# Altium schematic sheet MCU.SchDoc
size 420 x 297 mm; SheetNumber: 4; SheetTotal: 6
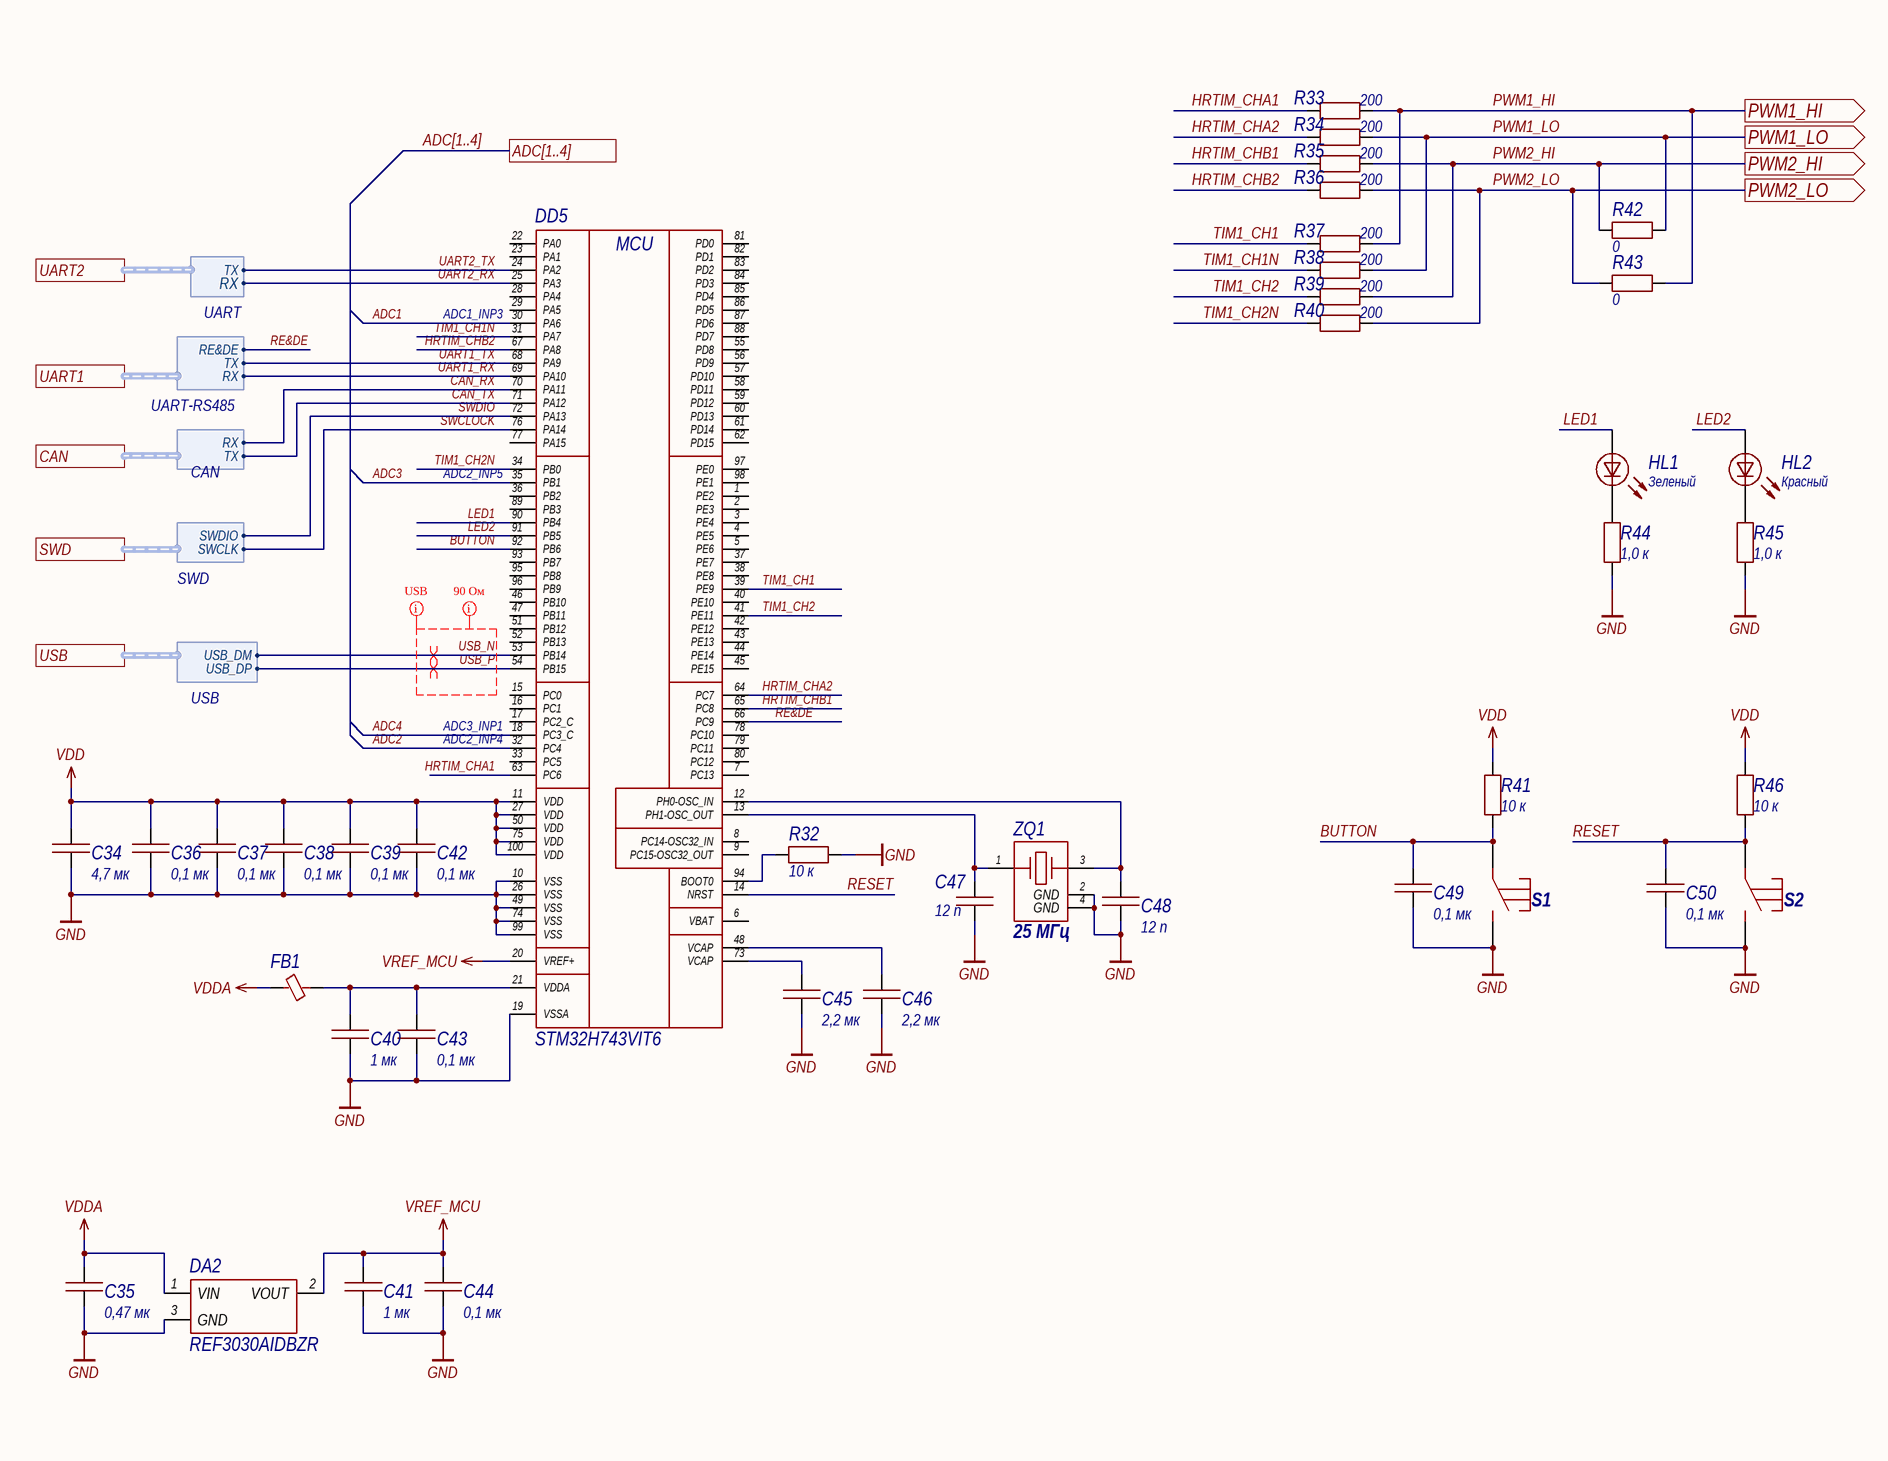
[diagram p0: MCU.SchDoc, left]
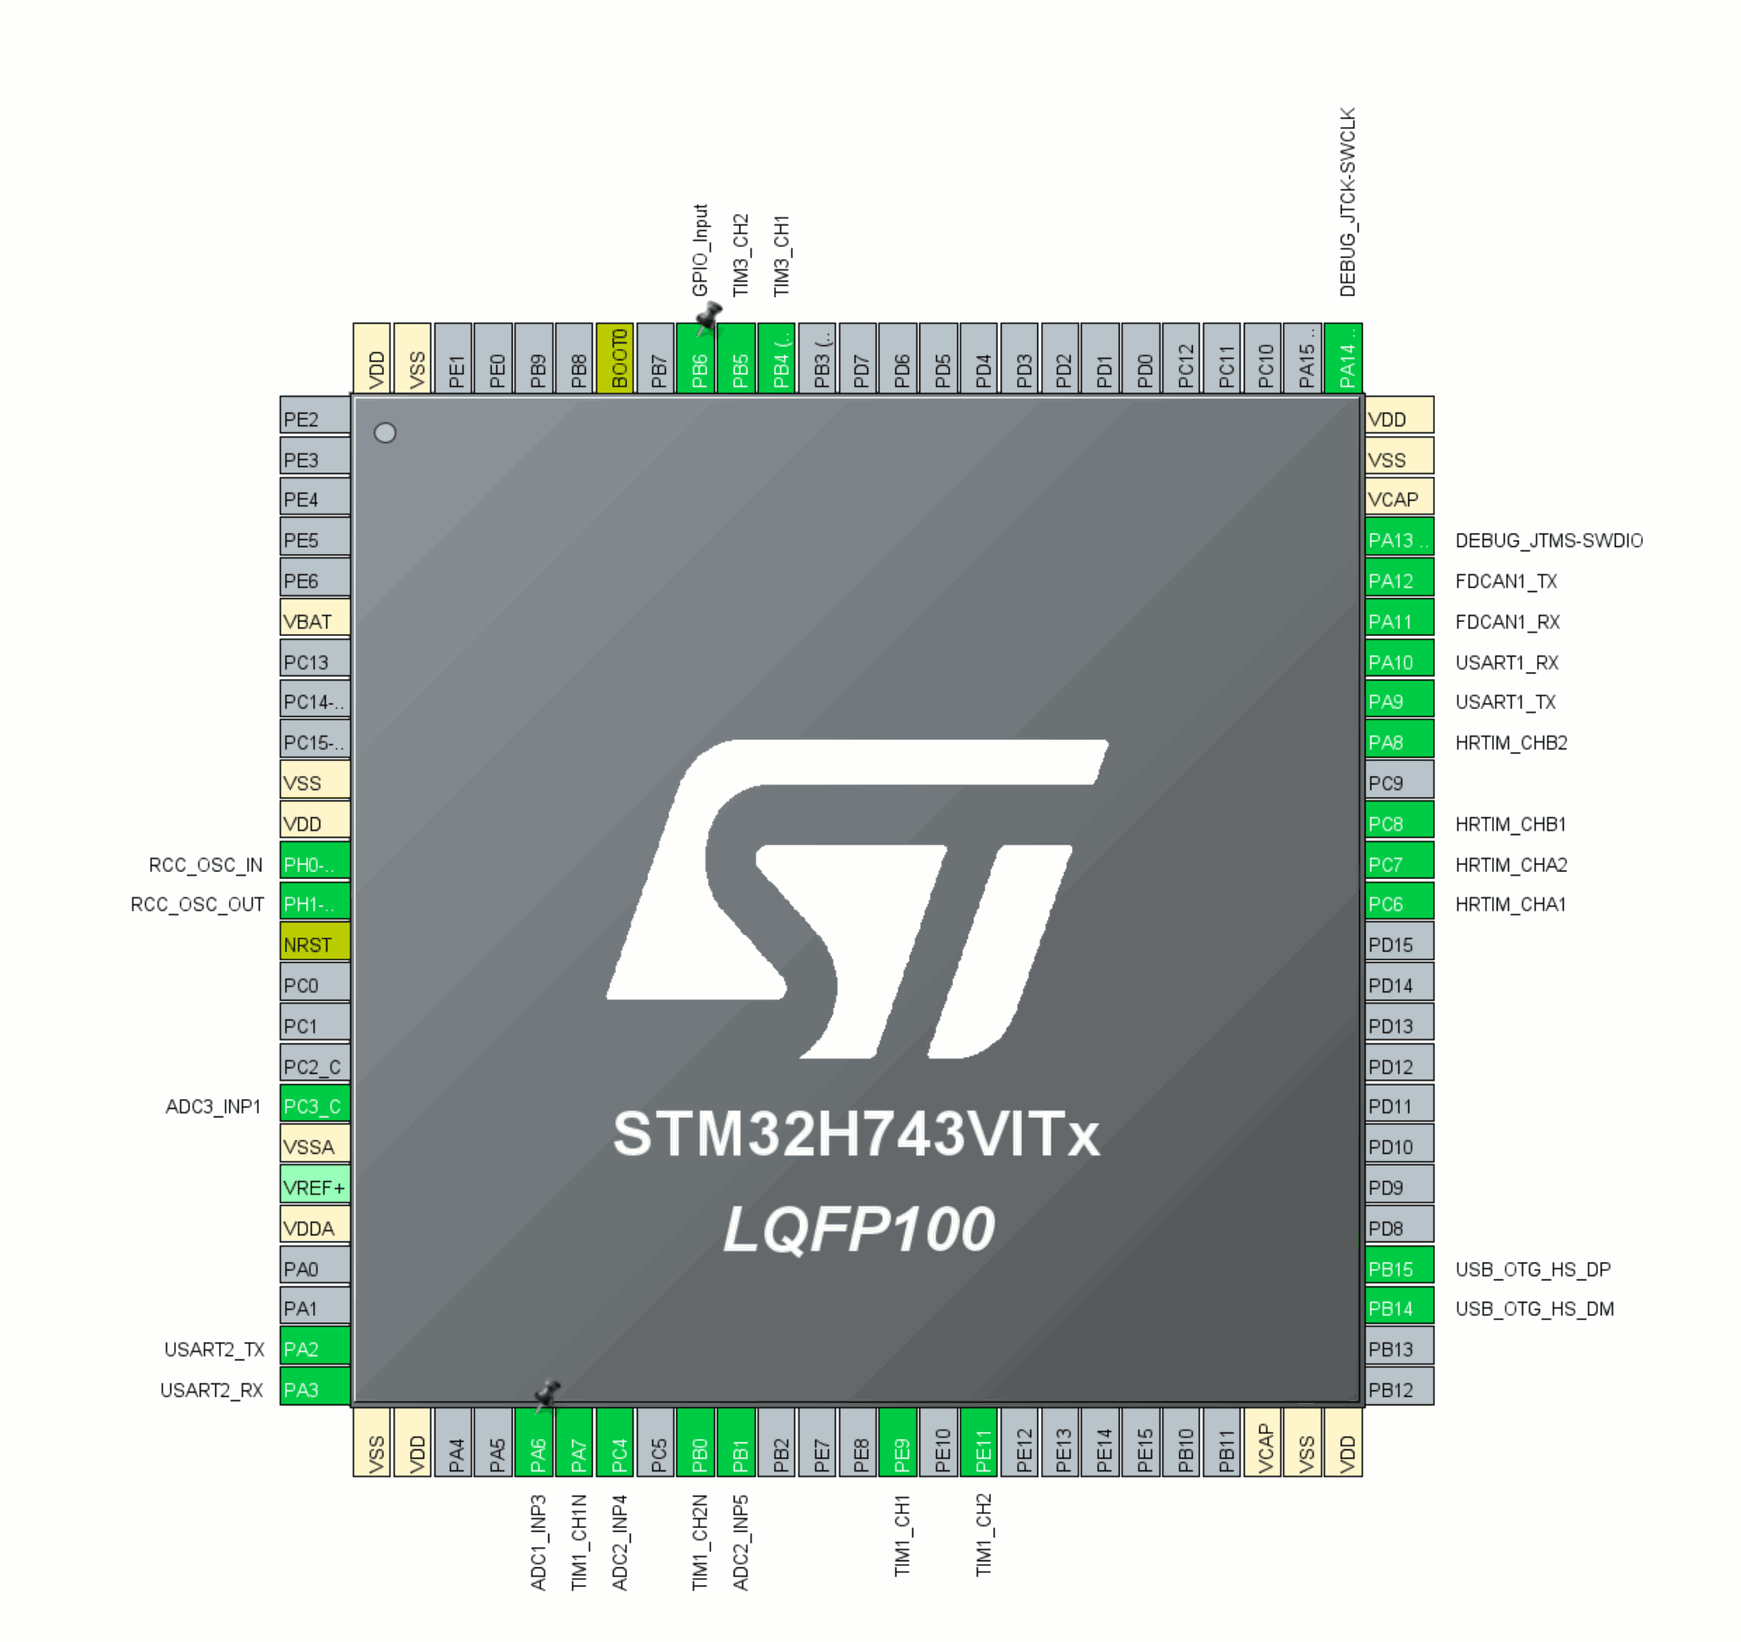
[diagram p1: MCU.SchDoc, right]

## Parts
C34  value 4,7 мк  [1206C]  (hidden comment: Capacitor)
C35  value 0,47 мк  [0603C]  (hidden comment: Capacitor)
C36  value 0,1 мк  [0603C]  (hidden comment: Capacitor)
C37  value 0,1 мк  [0603C]  (hidden comment: Capacitor)
C38  value 0,1 мк  [0603C]  (hidden comment: Capacitor)
C39  value 0,1 мк  [0603C]  (hidden comment: Capacitor)
C40  value 1 мк  [0603C]  (hidden comment: Capacitor)
C41  value 1 мк  [0603C]  (hidden comment: Capacitor)
C42  value 0,1 мк  [0603C]  (hidden comment: Capacitor)
C43  value 0,1 мк  [0603C]  (hidden comment: Capacitor)
C44  value 0,1 мк  [0603C]  (hidden comment: Capacitor)
C45  value 2,2 мк  [1206C]  (hidden comment: Capacitor)
C46  value 2,2 мк  [1206C]  (hidden comment: Capacitor)
C47  value 12 п  [0603C]  (hidden comment: Capacitor)
C48  value 12 п  [0603C]  (hidden comment: Capacitor)
C49  value 0,1 мк  [0603C]  (hidden comment: Capacitor)
C50  value 0,1 мк  [0603C]  (hidden comment: Capacitor)
DA2  REF3030AIDBZR  [SOT23-3]
DD5  STM32H743VIT6  [LQFP100]
FB1  BLM18AG102SN1D  [0603L]  (value not drawn)
HL1  value Зеленый  [0805D]  (hidden comment: LED)
HL2  value Красный  [0805D]  (hidden comment: LED)
R32  value 10 к  [0603R]  (hidden comment: Resistor)
R33  value 200  [0603R]  (hidden comment: Resistor)
R34  value 200  [0603R]  (hidden comment: Resistor)
R35  value 200  [0603R]  (hidden comment: Resistor)
R36  value 200  [0603R]  (hidden comment: Resistor)
R37  value 200  [0603R]  (hidden comment: Resistor)
R38  value 200  [0603R]  (hidden comment: Resistor)
R39  value 200  [0603R]  (hidden comment: Resistor)
R40  value 200  [0603R]  (hidden comment: Resistor)
R41  value 10 к  [0603R]  (hidden comment: Resistor)
R42  value 0  [0603R]  (hidden comment: Resistor)
R43  value 0  [0603R]  (hidden comment: Resistor)
R44  value 1,0 к  [0603R]  (hidden comment: Resistor)
R45  value 1,0 к  [0603R]  (hidden comment: Resistor)
R46  value 10 к  [0603R]  (hidden comment: Resistor)
S1  TSS-TD-19XA-XTR  [TSS-TD-19XA-XTR]  (value not drawn)
S2  TSS-TD-19XA-XTR  [TSS-TD-19XA-XTR]  (value not drawn)
ZQ1  value 25 МГц  [X322525MOB4SI]  (hidden comment: X322525MOB4SI)

## Ports
ADC[1..4], CAN (harness CAN), PWM1_HI (out), PWM1_LO (out), PWM2_HI (out), PWM2_LO (out), SWD (harness SWD), UART1 (harness UART-RS485), UART2 (harness UART), USB (harness USB)

## Harnesses
UART: TX, RX
UART-RS485: TX, RX, RE&DE
USB: USB_DM, USB_DP
SWD: SWDIO, SWCLK
CAN: TX, RX

## Nets
GND: C34.1 C35.1 C36.1 C37.1 C38.1 C39.1 C40.1 C41.1 C42.1 C43.1 C44.1 C45.1 C46.1 C47.1 C48.1 C49.1 C50.1 DA2.3(GND) DD5.10(VSS) DD5.19(VSSA) DD5.26(VSS) DD5.49(VSS) DD5.74(VSS) DD5.99(VSS) R32.1 R44.1 R45.1 S1.2 S2.2 ZQ1.2(GND) ZQ1.4(GND)
VDD: C34.2 C36.2 C37.2 C38.2 C39.2 C42.2 DD5.11(VDD) DD5.27(VDD) DD5.50(VDD) DD5.75(VDD) DD5.100(VDD) R41.2 R46.2
VDDA: C35.2 DA2.1(VIN) FB1.1
VREF_MCU: C41.2 C44.2 DA2.2(VOUT) DD5.20(VREF+)
ADC1: DD5.30(PA6)
ADC2: DD5.32(PC4)
ADC3: DD5.35(PB1)
ADC4: DD5.18(PC3_C)
BUTTON: C49.2 DD5.92(PB6) R41.1 S1.1
CAN_RX: DD5.70(PA11) ; port CAN.RX
CAN_TX: DD5.71(PA12) ; port CAN.TX
HRTIM_CHA1: DD5.63(PC6) R33.1
HRTIM_CHA2: DD5.64(PC7) R34.1
HRTIM_CHB1: DD5.65(PC8) R35.1
HRTIM_CHB2: DD5.67(PA8) R36.1
LED1: DD5.90(PB4) HL1.1
LED2: DD5.91(PB5) HL2.1
PWM1_HI: R33.2 R37.2 R43.2 ; port PWM1_HI
PWM1_LO: R34.2 R38.2 R42.2 ; port PWM1_LO
PWM2_HI: R35.2 R39.2 R42.1 ; port PWM2_HI
PWM2_LO: R36.2 R40.2 R43.1 ; port PWM2_LO
RE&DE: DD5.66(PC9) ; port UART1.RE&DE
RESET: C50.2 DD5.14(NRST) R46.1 S2.1
SWCLOCK: DD5.76(PA14) ; port SWD.SWCLK
SWDIO: DD5.72(PA13) ; port SWD.SWDIO
TIM1_CH1: DD5.39(PE9) R37.1
TIM1_CH1N: DD5.31(PA7) R38.1
TIM1_CH2: DD5.41(PE11) R39.1
TIM1_CH2N: DD5.34(PB0) R40.1
UART1_RX: DD5.69(PA10) ; port UART1.RX
UART1_TX: DD5.68(PA9) ; port UART1.TX
UART2_RX: DD5.25(PA3) ; port UART2.RX
UART2_TX: DD5.24(PA2) ; port UART2.TX
USB_N: DD5.53(PB14) ; port USB.USB_DM
USB_P: DD5.54(PB15) ; port USB.USB_DP
NetC40_2: C40.2 C43.2 DD5.21(VDDA) FB1.2
NetC45_2: C45.2 DD5.73(VCAP)
NetC46_2: C46.2 DD5.48(VCAP)
NetC47_2: C47.2 DD5.13(PH1-OSC_OUT) ZQ1.1
NetC48_2: C48.2 DD5.12(PH0-OSC_IN) ZQ1.3
NetDD5_94: DD5.94(BOOT0) R32.2
NetHL1_2: HL1.2 R44.2
NetHL2_2: HL2.2 R45.2

Not connected (* = marked no-connect by the designer): DD5 1(PE2) 2(PE3) 3(PE4) 4(PE5) 5(PE6) 6(VBAT) 7(PC13) 8(PC14-OSC32_IN) 9(PC15-OSC32_OUT) 15(PC0) 16(PC1) 17(PC2_C) 22(PA0) 23(PA1) 28(PA4) 29(PA5) 33(PC5) 36(PB2) 37(PE7) 38(PE8) 40(PE10) 42(PE12) 43(PE13) 44(PE14) 45(PE15) 46(PB10) 47(PB11) 51(PB12) 52(PB13) 55(PD8) 56(PD9) 57(PD10) 58(PD11) 59(PD12) 60(PD13) 61(PD14) 62(PD15) 77(PA15) 78(PC10) 79(PC11) 80(PC12) 81(PD0) 82(PD1) 83(PD2) 84(PD3) 85(PD4) 86(PD5) 87(PD6) 88(PD7) 89(PB3) 93(PB7) 95(PB8) 96(PB9) 97(PE0) 98(PE1)

## Buses and harness runs
bus ADC[1..4] = port ADC[1..4]

## Layout directives
differential pair; differential pair class 90OhmDiff: USB_N, USB_P
mark named USB: USB_N, USB_P
mark named 90 Ом: USB_N, USB_P

## Notes on the sheet
- (near DD5) ADC1_INP3
- (near DD5) ADC2_INP5
- (near DD5) ADC3_INP1
- (near DD5) ADC2_INP4
- Перв. примен.
- Справ. №
- Подп. и дата
- Инв. № дубл.
- Взам. инв. №
- Инв. № подл.
- Изм.
- Лист
- № докум.
- Подп.
- Дата
- Копировал
- Формат А3
- (in symbol STM32H743VIT6) MCU

## Library data of the parts
C34 = Capacitor_4,7u_10_50V_X7R_1206C: Конденсатор 1206C ёмкостью 4,7 мк 10%, 50 В, X7R; Voltage (V): 50; Capacity (nF): 4700; Part Number: Capacitor_4,7u_10_50V_X7R_1206C; Tolerance: 10%; Dielectric: X7R
C35 = Capacitor_0,47u_10_50V_X7R_0603C: Конденсатор 0603C ёмкостью 0,47 мк 10%, 50 В, X7R; Voltage (V): 50; Capacity (nF): 470; Part Number: Capacitor_0,47u_10_50V_X7R_0603C; Tolerance: 10%; Dielectric: X7R
C36-C39 C42-C44 C49 C50 = Capacitor_0,1u_10_50V_X7R_0603C: Конденсатор 0603C ёмкостью 0,1 мк 10%, 50 В, X7R; Voltage (V): 50; Capacity (nF): 100; Part Number: Capacitor_0,1u_10_50V_X7R_0603C; Tolerance: 10%; Dielectric: X7R
C40 C41 = Capacitor_1u_10_25V_X7R_0603C: Конденсатор 0603C ёмкостью 1 мк 10%, 25 В, X7R; Voltage (V): 25; Capacity (nF): 1000; Part Number: Capacitor_1u_10_25V_X7R_0603C; Tolerance: 10%; Dielectric: X7R
C45 C46 = Capacitor_2,2u_10_50V_X7R_1206C: Конденсатор 1206C ёмкостью 2,2 мк 10%, 50 В, X7R; Voltage (V): 50; Capacity (nF): 2200; Part Number: Capacitor_2,2u_10_50V_X7R_1206C; Tolerance: 10%; Dielectric: X7R
C47 C48 = Capacitor_12p_5_50V_NP0_0603C: Конденсатор 0603C ёмкостью 12 п 5%, 50 В, NP0; Voltage (V): 50; Capacity (nF): 0,012; Автор: glebmih; Part Number: Capacitor_12p_5_50V_NP0_0603C; Tolerance: 5%; Dielectric: NP0
DA2 = REF3030AIDBZR: Источник опорного напряжения, 3В; Автор: glebmih; Part Number: REF3030AIDBZR; Datasheet: https://static.chipdip.ru/lib/248/DOC000248445.pdf
DD5 = STM32H743VIT6: Микроконтроллер, 32-Бит, Cortex-M7, 480МГц, 2Мб Flash, 1Мб SRAM, 82 I/O; MF: STMicroelectronics; Автор: glebmih; SnapEDA_Link: https://www.snapeda.com/parts/STM32H743VIT6/STMicroelectronics/view-part/?ref=snap; Package: LQFP-100 STMicroelectronics; Value: *; MP: STM32H743VIT6; Check_prices: https://www.snapeda.com/parts/STM32H743VIT6/STMicroelectronics/view-part/?ref=eda; Part Number: STM32H743VIT6; Datasheet: https://static.chipdip.ru/lib/529/DOC010529789.pdf
FB1 = BLM18AG102SN1D: Дроссель подавления ЭМП; Автор: glebmih; Part Number: BLM18AG102SN1D; Datasheet: https://www.chipdip.ru/product/blm18ag102sn1d-1-kom-0.4a-0603-drossel-podavleniya-murata-9000029220
HL1 HL2 = LED: Светодиод; Part Number: LED
R32 R41 R46 = Resistor_10k_1_0603: Резистор номиналом 10 кОм 1%; Power: *; Part Number: Resistor_10k_1_0603; Tolerance: 1%
R33-R40 = Resistor_200_1_0603: Резистор номиналом 200 Ом 1%; Power: *; Part Number: Resistor_200_1_0603; Tolerance: 1%
R42 R43 = Resistor_0_5_0603: Резистор номиналом 0 Ом 5%; Автор: glebmih; Power: *; Part Number: Resistor_0_5_0603; Tolerance: 5%
R44 R45 = Resistor_1.0k_1_0603: Резистор номиналом 1,0 кОм 1%; Power: *; Part Number: Resistor_1.0k_1_0603; Tolerance: 1%
S1 S2 = TSS-TD-19XA-XTR: Тактовая кнопка; Автор: glebmih; Part Number: TSS-TD-19XA-XTR; Datasheet: https://cdn.promelec.ru/upload/items/2023/04/17/TSS-TD-19XA.pdf
ZQ1 = X322525MOB4SI: Кварцевый резонатор SMD 25 МГц ±10ppm SMD-3225_4P; Автор: rreali; Part Number: X322525MOB4SI; Datasheet: https://datasheet.lcsc.com/lcsc/Yangxing-Tech-X322525MOB4SI_C9006.pdf